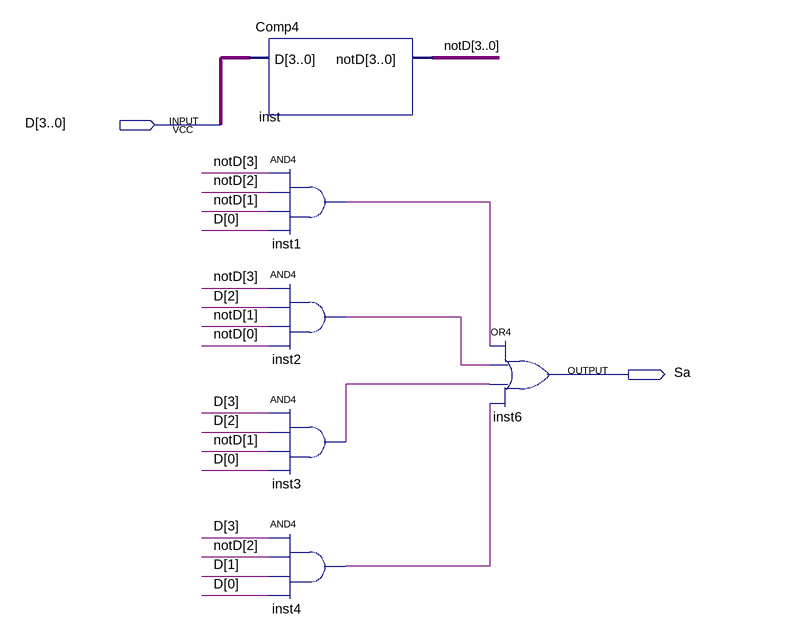
[diagram p0: schematic sheet]
// Quartus schematic Sa.bdf as structural Verilog: 6 symbols, 2 pins
module Sa (
  input  [3:0] D,
  output Sa
);

  wire inst1_out, inst2_out, inst3_out, inst4_out;
  wire [3:0] notD;

  Comp4 inst (.D(D), .notD(notD));
  and inst1 (inst1_out, notD[3], notD[2], notD[1], D[0]);
  and inst2 (inst2_out, notD[3], D[2], notD[1], notD[0]);
  and inst3 (inst3_out, D[3], D[2], notD[1], D[0]);
  and inst4 (inst4_out, D[3], notD[2], D[1], D[0]);
  or inst6 (Sa, inst1_out, inst2_out, inst3_out, inst4_out);
endmodule
